# EAGLE design sts30-dis-breakout (EAGLE 9.6.2)
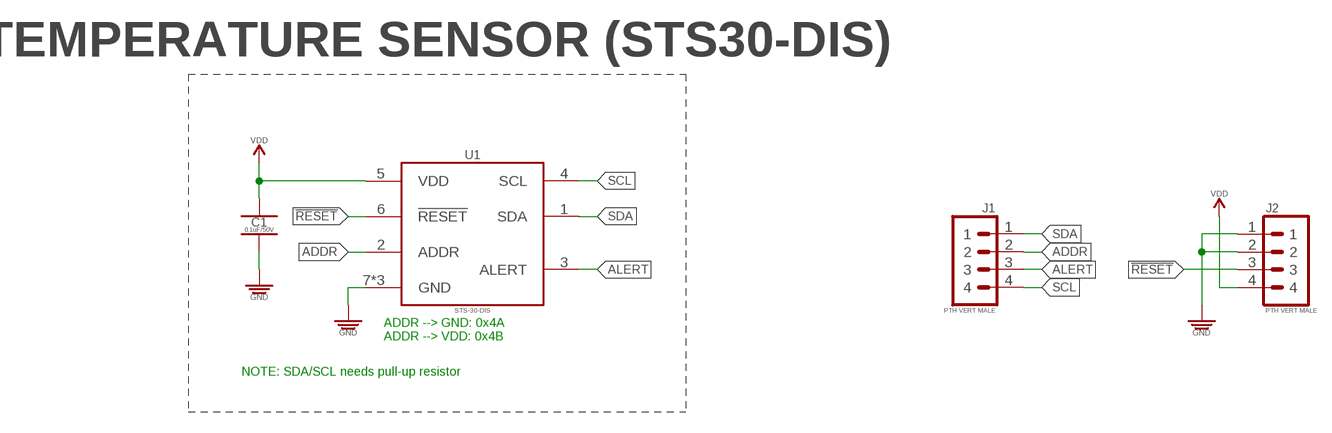
[diagram p0: schematic, sheet 1]

## Parts
C1  0.1uF/50V  0.1UF_SMD-0402_50V-10%  [CAPC1005X55_SMD-0402]
J1  PTH VERT MALE  1X04_PTH_VERT_MALE_2.54MM  [HDRV4W64P254_1X4_1016X254X838B]
J2  PTH VERT MALE  1X04_PTH_VERT_MALE_2.54MM  [HDRV4W64P254_1X4_1016X254X838B]
U1  STS-30-DIS  STS3X-DISSTS30-DIS  [SON50P250X250X100-9T110X180N]

## Nets
!RESET!: J2.3 U1.6(!RESET!)
ADDR: J1.2 U1.2(ADDR)
ALERT: J1.3 U1.3(ALERT)
GND: C1.2 J2.1 J2.2 U1.7(GND) U1.8(GND) U1.9(GND)
SCL: J1.4 U1.4(SCL)
SDA: J1.1 U1.1(SDA)
VDD: C1.1 J2.4 U1.5(VDD)

## Notes on the sheet
- TEMPERATURE SENSOR (STS30-DIS)
- ADDR --> GND: 0x4A
  ADDR --> VDD: 0x4B
- NOTE: SDA/SCL needs pull-up resistor

## Library data of the parts
C1 = _capacitors:0.1UF; DATASHEET: https://product.tdk.com/info/en/catalog/datasheets/mlcc_commercial_soft_en.pdf; DIST: Digikey; DISTLINK: https://www.digikey.com/products/en?keywords=445-173610-1-ND; DISTPN: 445-173610-1-ND; MFR: TDK Corporation; MPN: C1005X7R1H104K050BE
J1 J2 = _connectors:1X04; DATASHEET: https://drawings-pdf.s3.amazonaws.com/C10436.pdf; DIST: Digikey; DISTLINK: https://www.digikey.com/products/en?keywords=PEC04SAAN; DISTPN: S1012E-04-ND; MFR: Sullins Connector Solutions; MPN: PEC04SAAN
U1 = _sensors:STS3X-DIS; DATASHEET: https://www.sensirion.com/file/datasheet_sts3x; DIST: Digikey; DISTLINK: https://www.digikey.com/en/products/detail/sensirion-ag/STS-30-DIS/6194944?s=N4IgTCBcDaIIwDYAsBOAtHADAgzBtAcgCIgC6AvkA; DISTPN: 1649-1063-1-ND; MFR: Sensirion AG; MPN: STS-30-DIS

## Board
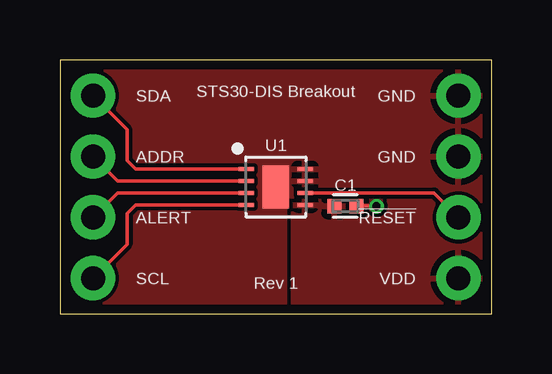
[diagram p1: board, top side]
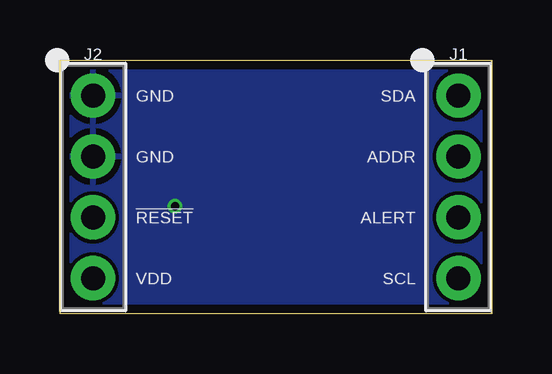
[diagram p2: board, bottom side, seen from below]

Size 18 x 10.6 mm. Coordinates in mm from the lower left corner, seen from the top.
Outline: 0,0 18,0 18,10.6 0,10.6 0,0
Copper layers (1*16): Top 0.035559375mm / dielectric 1.6mm / Bottom 0.035559375mm
Design rules "oshpark-2layer": minimum track width 6mil, minimum drill 10mil, track to track 6mil, track to pad 6mil, pad to pad 6mil, via to via 6mil, smd to smd 6mil, copper to edge 15mil, drill to drill 6mil, minimum pad ring 5mil, minimum via ring 5mil, stop-mask expansion 2.5mil, vias tented up to drill 0mil, thermal gap 10mil

### Footprints (pad centres in the part's own frame; a part is rotated, then mirrored left to right if it is on the bottom)
CAPC1005X55_SMD-0402 = smd 0.585 x 0.612: 1 -0.458,0; 2 0.458,0
HDRV4W64P254_1X4_1016X254X838B = drill 1 pad 1.85: 1 -3.81,0; 2 -1.27,0; 3 1.27,0; 4 3.81,0
SON50P250X250X100-9T110X180N = smd 0.65 x 0.17: 1 -1.225,0.75; 2 -1.225,0.25; 3 -1.225,-0.25; 4 -1.225,-0.75; 5 1.225,-0.75; 6 1.225,-0.25; 7 1.225,0.25; 8 1.225,0.75 | smd 1.1 x 1.8: 9 0,0

### Placement (x,y rotation side)
C1  11.9,4.5 0 top
J1  1.38,5.3 270 bottom
J2  16.62,5.3 270 bottom
U1  9,5.3 0 top

### Tracks (layer width: path | path; a pad name or v marks a point on that pad's centre or on a via)
!RESET!
  Top 0.152: U1.6 15.6,5.05 J2.3
ADDR
  Top 0.152: U1.2 2.4,5.55 J1.2
ALERT
  Top 0.152: J1.3 2.4,5.05 U1.3
GND  (via drill 0.35)
  Top 0.152: C1.2 v13.2,4.5
  pour Bottom (rank 6): 0,0 18,0 18,10.6 0,10.6
  pour Top (rank 5): 0,0 18,0 18,10.6 0,10.6
SCL
  Top 0.152: U1.4 3.15,4.55 2.8,4.2 2.8,2.91 J1.4
SDA
  Top 0.152: U1.1 3.15,6.05 2.8,6.4 2.8,7.69 J1.1
VDD
  pour Top: 9.7,4.8 9.7,0 18,0 18,4 18,4.8

### Text on the board
tPlace: SDA | STS30-DIS Breakout | GND | ADDR | GND | ALERT | !RESET! | SCL | Rev 1 | VDD
bPlace: SDA | GND | ADDR | GND | ALERT | !RESET! | SCL | VDD